# EasyEDA Pro project EasyEDA_DEHHANI_Yassine_Evaluation2_Electronique.epro

# Schematic Schematics
Board Name: Board1; Create Date: 2024-12-16; Page Name: Circuit; Project Name: DEHHANI_Yassine_Evaluation2_Electronique; Schematic Name: Schematics; Update Date: 2024-12-16; Company: EasyEDA.com; Page Size: A4; Version: V1.0
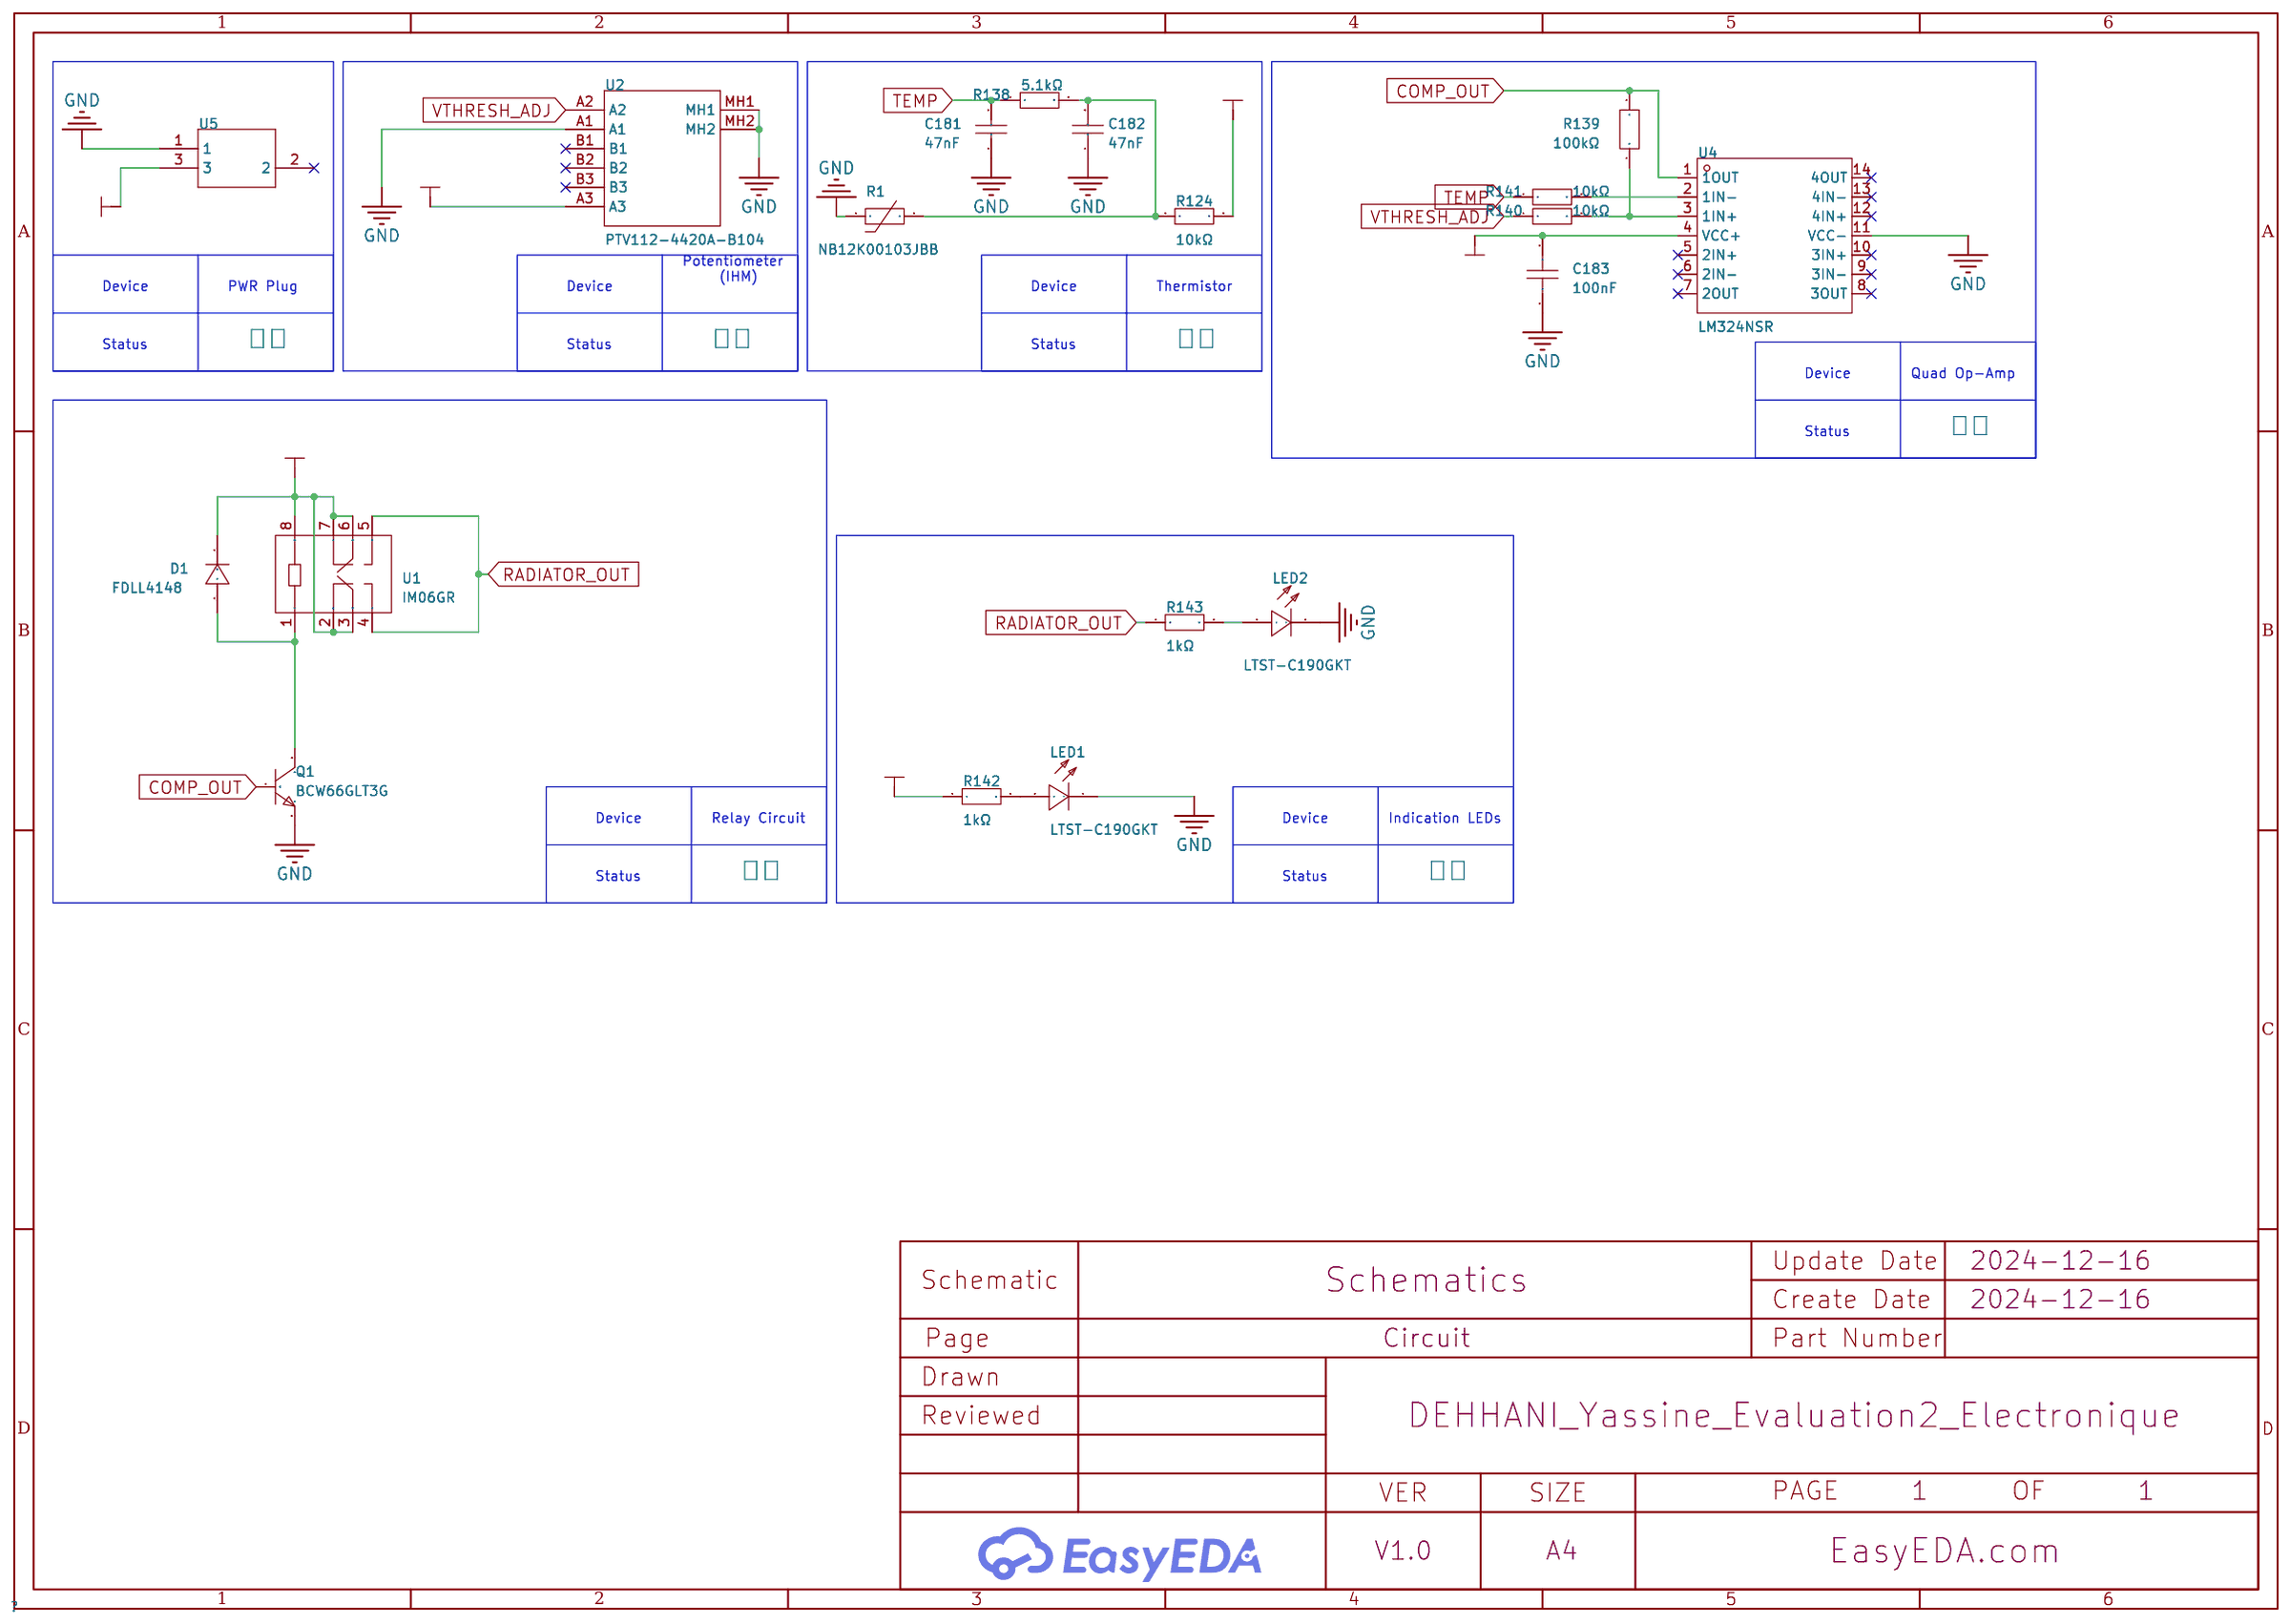
[diagram p0: schematic sheet]

## Parts
C181  47nF  [C0402]
C182  47nF  [C0402]
C183  100nF  [C0805]
D1  FDLL4148  [SOD-80_L3.5-W1.5-RD]
LED1  LTST-C190GKT  [LED0603-RD]
LED2  LTST-C190GKT  [LED0603-RD]
Q1  BCW66GLT3G  [SOT-23-3_L2.9-W1.3-P1.90-LS2.4-BR]
R1  NB12K00103JBB  [R0805]
R124  10kΩ  [R0402]
R138  5.1kΩ  [R0402]
R139  100kΩ  [R0805]
R140  10kΩ  [R0805]
R141  10kΩ  [R0805]
R142  1kΩ  [R0805]
R143  1kΩ  [R0805]
U1  IM06GR  [RELAY-SMD_IMXXGR]
U2  PTV112-4420A-B104  [PTV1124420AB104]
U4  LM324NSR  [SO-14_L10.2-W5.3-P1.27-LS7.8-BL]
U5  -  [PJ1021SMTTR]

## Library data of the parts
C181 C182 = 0402B473K500NT: Capacitance:47nF Tolerance:±10% Tolerance:±10% Voltage Rated: Temperature Coefficient:; LCSC Part Name: 47nF ±10% 50V; Supplier Part: C82219; Manufacturer: FH(风华); Supplier Footprint: 0402; JLCPCB Part Class: Extended Part; Datasheet: https://atta.szlcsc.com/upload/public/pdf/source/20200305/C486355_26A10D38EF8C2A5C37091D0039909270.pdf; Supplier: LCSC; Tolerance: ±10%
C183 = CC0805KRX7R9BB104: Capacitance: Tolerance:±10% Tolerance:±10% Voltage Rated: Temperature Coefficient:; LCSC Part Name: 100nF ±10% 50V; Supplier Part: C49678; Manufacturer: YAGEO(国巨); Supplier Footprint: 0805; JLCPCB Part Class: Basic Part; Datasheet: https://atta.szlcsc.com/upload/public/pdf/source/20180224/C181747_15194369449651363981.pdf; Supplier: LCSC; Tolerance: ±10%
D1 = FDLL4148: Diode Configuration: Forward Voltage (Vf@If):1V@10mA Reverse Voltage (Vr): Rectified Current: Reverse Leakage Current:5uA@75V Reverse Recovery Time (trr): Operating Temperature:-55℃~+175℃ Operating Temperature:-55℃~+175℃; LCSC Part Name: 电压:100V 电流:200mA; Supplier Part: C78608; Manufacturer: onsemi(安森美); Supplier Footprint: SOD-80; JLCPCB Part Class: Extended Part; Datasheet: https://atta.szlcsc.com/upload/public/pdf/source/20221020/952944402E52E23E5C6A007D10038C14.pdf; Supplier: LCSC; Forward Voltage (Vf@If): 1V@10mA; Reverse Leakage Current: 5uA@75V; Operating Temperature: -55℃~+175℃
LED1 LED2 = LTST-C190GKT: Emitted Color:Yellow Green Forward Voltage (VF):2.1V Forward Voltage (VF):2.1V Power Dissipation:100mW Forward Current:20mA Dominant Wavelength:569nm Dominant Wavelength:569nm Peak Wavelength:565nm Diode Configuration:- Lens Color:Colorless Transparent Le; LCSC Part Name: 普绿/黄绿; Supplier Part: C125093; Manufacturer: LITEON(光宝); Supplier Footprint: 0603; JLCPCB Part Class: Extended Part; Datasheet: https://atta.szlcsc.com/upload/public/pdf/source/20180326/C125093_24EC4C6D214E1CE2A6C2F0B82DCA7C02.pdf; Supplier: LCSC; Emitted Color: Yellow Green; Forward Voltage (VF): 2.1V; Power Dissipation: 100mW; Forward Current: 20mA; Dominant Wavelength: 569nm; Peak Wavelength: 565nm; Lens Color: Colorless Transparent Lens; Luminous Intensity: 6mcd; Viewing Angle: 130°; Operating Temperature: -55℃~+85℃
Q1 = BCW66GLT3G: Transistor Type: Collector Current (Ic): Collector-Emitter Breakdown Voltage (Vceo): Power Dissipation (Pd): DC Current Gain (hFE@Ic,Vce):160@100mA,1V DC Current Gain (hFE@Ic,Vce):160@100mA,1V Transition Frequency (fT):100MHz Collector Cut-Off Current (Ic; LCSC Part Name: 耐压:45V 电流:800mA NPN; Supplier Part: C896685; Manufacturer: onsemi(安森美); Supplier Footprint: SOT-23; JLCPCB Part Class: Extended Part; Datasheet: https://atta.szlcsc.com/upload/public/pdf/source/20210816/F4BA3618189A24FF990142DF8F515235.pdf; Supplier: LCSC; DC Current Gain (hFE@Ic,Vce): 160@100mA,1V; Transition Frequency (fT): 100MHz; Collector Cut-Off Current (Icbo): 20nA; Collector-Emitter Saturation Voltage (VCE(sat)@Ic,Ib): 250mV@100mA,5mA; Operating Temperature: -55℃~+150℃@(Tj)
R1 = NB12K00103JBB: Supplier Part: C597653; Manufacturer: Kyocera AVX; Supplier Footprint: 0805; JLCPCB Part Class: Extended Part; Datasheet: https://atta.szlcsc.com/upload/public/pdf/source/20230915/A3198BCB39D04DCD6DE66241F305DBB6.pdf; Supplier: LCSC
R124 = RC0402FR-0710KL: Type:Thick Film Resistors Resistance: Tolerance:±1% Tolerance:±1% Power(Watts): Overload Voltage (Max): Temperature Coefficient:±100ppm/℃ Temperature Coefficient:±100ppm/℃ Operating Temperature Range:-55℃~+155℃ Operating Temperature Range:-55℃~+155℃; LCSC Part Name: 厚膜电阻 10kΩ ±1% 62.5mW; Supplier Part: C60490; Manufacturer: YAGEO(国巨); Supplier Footprint: 0402; JLCPCB Part Class: Extended Part; Datasheet: https://atta.szlcsc.com/upload/public/pdf/source/20170925/C131467_1506321478108990263.pdf; Supplier: LCSC; Type: Thick Film Resistors; Tolerance: ±1%; Temperature Coefficient: ±100ppm/℃; Operating Temperature Range: -55℃~+155℃
R138 = RK73H1ETTP5101F: Type:Thick Film Resistors Resistance: Tolerance:±1% Tolerance:±1% Power(Watts): Overload Voltage (Max): Temperature Coefficient:±100ppm/℃ Temperature Coefficient:±100ppm/℃ Operating Temperature Range:-55℃~+155℃ Operating Temperature Range:-55℃~+155℃; LCSC Part Name: 厚膜电阻 5.1kΩ ±1% 100mW; Supplier Part: C159990; Manufacturer: KOA; Supplier Footprint: 0402; JLCPCB Part Class: Extended Part; Datasheet: https://atta.szlcsc.com/upload/public/pdf/source/20190516/C346145_73DC9C40D36D5A63BE57BD2EFB7F1781.pdf; Supplier: LCSC; Type: Thick Film Resistors; Tolerance: ±1%; Temperature Coefficient: ±100ppm/℃; Operating Temperature Range: -55℃~+155℃
R139 = SCR0805J100K: Type:Thick Film Resistors Resistance: Tolerance:±5% Tolerance:±5% Power(Watts): Overload Voltage (Max): Operating Temperature Range:-55℃~+155℃ Operating Temperature Range:-55℃~+155℃; LCSC Part Name: 厚膜电阻 100kΩ ±5% 125mW; Supplier Part: C3017875; Manufacturer: VO(翔胜); Supplier Footprint: 0805; JLCPCB Part Class: Extended Part; Datasheet: https://atta.szlcsc.com/upload/public/pdf/source/20220513/247AF9639BA21CF93567DC289CCC6A22.pdf; Supplier: LCSC; Type: Thick Film Resistors; Tolerance: ±5%; Operating Temperature Range: -55℃~+155℃
R140 R141 = RC0805FR-0710KL: Type:Thick Film Resistors Resistance: Tolerance:±1% Tolerance:±1% Power(Watts): Overload Voltage (Max): Temperature Coefficient:±100ppm/℃ Temperature Coefficient:±100ppm/℃ Operating Temperature Range:-55℃~+155℃ Operating Temperature Range:-55℃~+155℃; LCSC Part Name: 厚膜电阻 10kΩ ±1% 125mW; Supplier Part: C84376; Manufacturer: YAGEO(国巨); Supplier Footprint: 0805; JLCPCB Part Class: Extended Part; Datasheet: https://atta.szlcsc.com/upload/public/pdf/source/20170708/1499509500945.pdf; Supplier: LCSC; Type: Thick Film Resistors; Tolerance: ±1%; Temperature Coefficient: ±100ppm/℃; Operating Temperature Range: -55℃~+155℃
R142 R143 = RC0805FR-071KL: Type:Thick Film Resistors Resistance: Tolerance:±1% Tolerance:±1% Power(Watts): Overload Voltage (Max): Temperature Coefficient:±100ppm/℃ Temperature Coefficient:±100ppm/℃ Operating Temperature Range:-55℃~+155℃ Operating Temperature Range:-55℃~+155℃; LCSC Part Name: 厚膜电阻 1kΩ ±1% 125mW; Supplier Part: C95781; Manufacturer: YAGEO(国巨); Supplier Footprint: 0805; JLCPCB Part Class: Extended Part; Datasheet: https://atta.szlcsc.com/upload/public/pdf/source/20170708/1499509500945.pdf; Supplier: LCSC; Type: Thick Film Resistors; Tolerance: ±1%; Temperature Coefficient: ±100ppm/℃; Operating Temperature Range: -55℃~+155℃
U1 = IM06GR: Coil Voltage:12V Contact Form:两组转换:2C(DPDT-转换) Contact Rating:- Maximum Switching Voltage:250V@AC；220V@DC Contact Material:- Coil Resistance:- Maximum Switching Current:2A Operate Time:3ms Release Time:3ms Coil Type:- Contact Resistance:- Operating Temper; LCSC Part Name: 12VDC 2A 无锁存; Supplier Part: C2153106; Manufacturer: TE Connectivity(泰科电子); Supplier Footprint: SMD,6x10mm; JLCPCB Part Class: Extended Part; Datasheet: https://atta.szlcsc.com/upload/public/pdf/source/20210703/113EB0DC59A6912044DEF7D49CC0F43B.pdf; Supplier: LCSC; Coil Voltage: 12V; Contact Form: 两组转换:2C(DPDT-转换); Maximum Switching Voltage: 250V@AC；220V@DC; Maximum Switching Current: 2A; Operate Time: 3ms; Release Time: 3ms; Operating Temperature: -40℃~+85℃
U2 = PTV112-4420A-B104
U4 = LM324NSR: Supplier Part: C2057487; Manufacturer: TI(德州仪器); Supplier Footprint: SO-14-208mil; JLCPCB Part Class: Extended Part; Datasheet: https://www.ti.com/cn/lit/gpn/lm224a; Supplier: LCSC
U5 = PJ1-021-SMT-TR

## Nets
+12V: C183.2 D1.1(C) R124.2 R142.1 U1.2 U1.3 U1.6 U1.7 U1.8 U2.A3 U4.4(VCC+) U5.3
GND: C181.1 C182.1 C183.1 LED1.1(-) LED2.1(-) Q1.2(E) R1.1 U2.A1 U2.MH1 U2.MH2 U4.11(VCC-) U5.1
COMP_OUT: Q1.1(B) R139.2 U4.1(1OUT)
RADIATOR_OUT: R143.1 U1.4 U1.5
TEMP: C181.2 R138.1 R141.1
VTHRESH_ADJ: R140.1 U2.A2
$1N1245: C182.2 R1.2 R124.1 R138.2
$1N1427: D1.2(A) Q1.3(C) U1.1
$1N2420: R139.1 R140.2 U4.3(1IN+)
$1N2469: R141.2 U4.2(1IN-)
$1N2706: LED1.2(+) R142.2
$1N3010: LED2.2(+) R143.2

Not connected (* = marked no-connect by the designer): U2 B1* B2* B3*; U4 5(2IN+)* 6(2IN-)* 7(2OUT)* 8(3OUT)* 9(3IN-)* 10(3IN+)* 12(4IN+)* 13(4IN-)* 14(4OUT)*; U5 2*

## Notes on the sheet
- Device
- PWR Plug
- Device
- Potentiometer
       (IHM)
- Device
- Thermistor
- Status
- ✓✓
- Status
- ✓✓
- Status
- ✓✓
- Device
- Quad Op-Amp
- Status
- ✓✓
- Device
- Relay Circuit
- Device
- Indication LEDs
- Status
- ✓✓
- Status
- ✓✓

# Board Radiator Control PCB
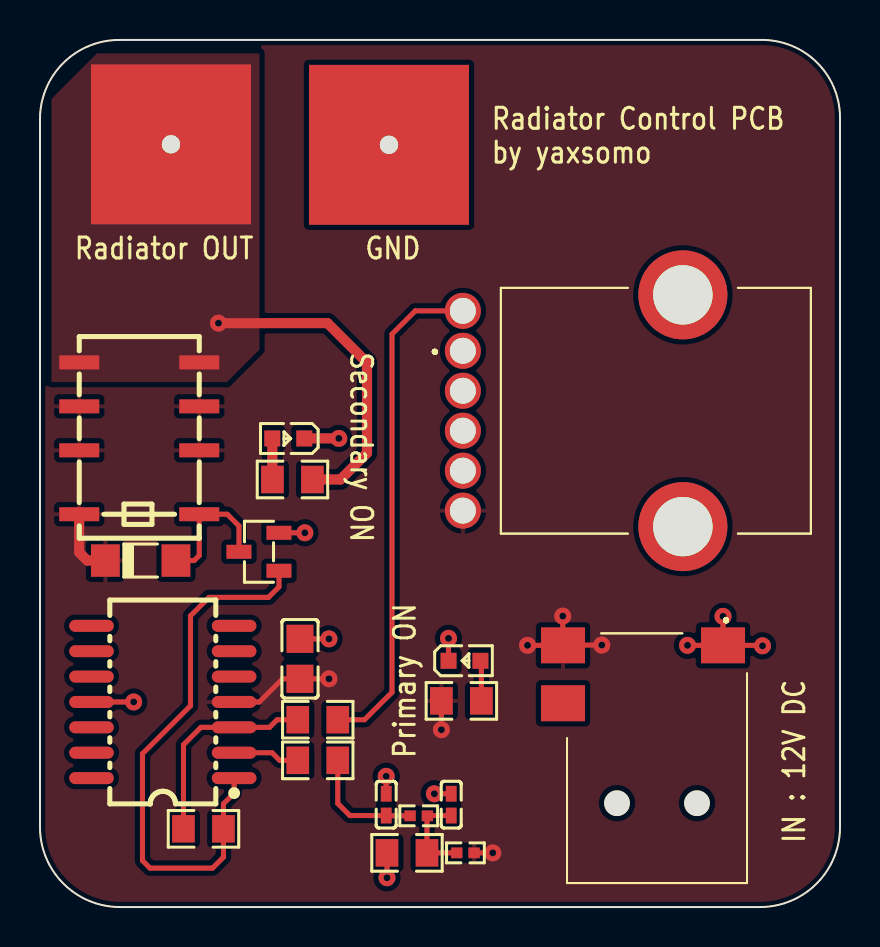
[diagram p1: board, top side]
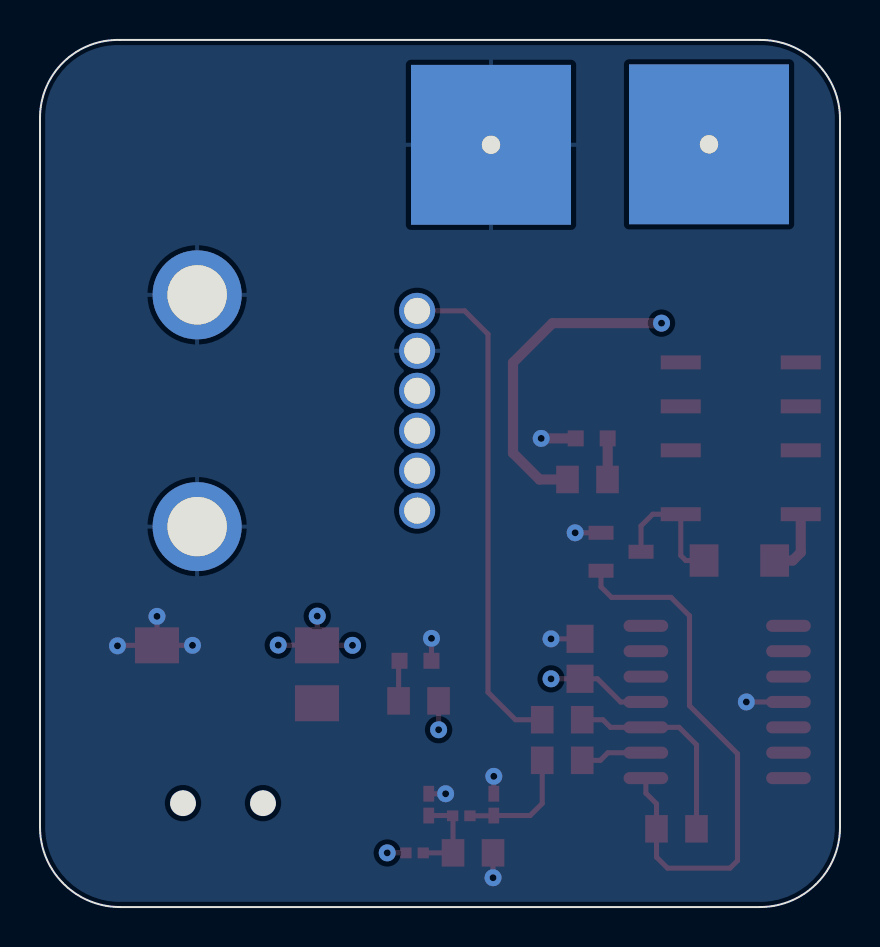
[diagram p2: board, bottom side, seen from below]

Outline 40 x 43.4 mm; copper layers: Top Layer, Bottom Layer. Coordinates in mm from the lower left corner of the outline.
Outline path: 0,39.45 0,4 arc(1.17,1.17) 4,0 36,0 arc(38.83,1.17) 40,4 40,39.52 arc(38.82,42.3) 36,43.4 4,43.4 arc(1.18,42.26) 0,39.45
Stack: Top Layer 0.035mm / Dielectric1 1.51mm FR4 er 4.5 / Bottom Layer 0.035mm

## Design rules (mm)
template: JLCPCB Capability(Two Layers Board)
spacing copperThickness1oz (default): track to track 0.102, other pairs 0.152 to 0.3
spacing copperThickness2oz: track to track 0.203, other pairs 0.152 to 0.3
track width copperThickness1oz (default): min 0.127, default 0.254, max 2.54
track width copperThickness2oz: min 0.203, default 0.254, max 2.54
differential pair differentialPair (default): width min 0.127, default 0.254, max 2.54; gap min 0.152, default 0.152
via viaSize (default): diameter min 0.5, default 0.61, max 10; hole min 0.3, default 0.305, max 6.3

## Placement (name value [footprint] x y rotation side)
C181  47nF  [C0402]  17.31 5.12 270 top
C182  47nF  [C0402]  20.56 5.12 270 top
C183  100nF  [C0805]  13 12.42 270 top
D1  FDLL4148  [SOD-80_L3.5-W1.5-RD]  5.03 17.34 0 top
LED1  LTST-C190GKT  [LED0603-RD]  21.22 12.32 0 top
LED2  LTST-C190GKT  [LED0603-RD]  12.42 23.46 180 top
NOREF  -  [Pad_e403]  17.45 38.15 0 top
NOREF#2  -  [Pad_e398]  6.55 38.18 0 top
Q1  BCW66GLT3G  [SOT-23-3_L2.9-W1.3-P1.90-LS2.4-BR]  10.95 17.78 0 top
R1  NB12K00103JBB  [R0805]  18.35 2.71 0 top
R124  10kΩ  [R0402]  21.27 2.71 0 top
R138  5.1kΩ  [R0402]  18.94 4.57 0 top
R139  100kΩ  [R0805]  8.17 3.91 0 top
R140  10kΩ  [R0805]  13.89 9.38 180 top
R141  10kΩ  [R0805]  13.89 7.34 180 top
R142  1kΩ  [R0805]  21.07 10.32 0 top
R143  1kΩ  [R0805]  12.62 21.4 180 top
U1  IM06GR  [RELAY-SMD_IMXXGR]  4.96 23.46 90 top
U2  PTV112-4420A-B104  [PTV1124420AB104]  21.14 27.84 270 top
U4  LM324NSR  [SO-14_L10.2-W5.3-P1.27-LS7.8-BL]  6.14 10.26 90 top
U5  -  [PJ1021SMTTR]  30.85 7.45 90 top

## Footprints (pads in the part's own frame, mm; a bottom-side part is the same pattern mirrored in y, then rotated)
C0402
  rect 0.79x0.54 smd: 1(-0.545,0) 2(0.545,0)
C0805
  rect 1.41x1.35 smd: 1(-1,0) 2(1,0)
LED0603-RD
  rect 0.8x0.8 smd: 1(-0.799,0) 2(0.799,0)
Pad_e398
  rect 8x8 hole 0.914: 1(0,0)
Pad_e403
  rect 8x8 hole 0.914: 1(0,0)
PJ1021SMTTR
  rect 1.8x2.2 smd: 1(5.65,-3.3) 2(2.75,4.7) 3(5.65,4.7)
PTV1124420AB104
  round 1.8 hole 1.3: A1(0,0) A2(-2,0) A3(8,0) B1(2,0) B2(4,0) B3(6,0)
  round 4.455 hole 2.97: MH1(-2.8,11) MH2(8.8,11)
R0402
  rect 0.566x0.54 smd: 1(-0.433,0) 2(0.433,0)
R0805
  rect 1.133x1.377 smd: 1(-1,0) 2(1,0)
RELAY-SMD_IMXXGR
  rect 0.7x2 smd: 1(-3.8,-3) 2(-0.6,-3) 3(1.6,-3) 4(3.8,-3) 5(3.8,3) 6(1.6,3) 7(-0.6,3) 8(-3.8,3)
SO-14_L10.2-W5.3-P1.27-LS7.8-BL
  oval 0.602x2.231 smd: 1(-3.81,-3.565) 2(-2.54,-3.565) 3(-1.27,-3.565) 4(0,-3.565) 5(1.27,-3.565) 6(2.54,-3.565) 7(3.81,-3.565) 8(3.81,3.566) 9(2.54,3.566) 10(1.27,3.566) 11(0,3.566) 12(-1.27,3.566) 13(-2.54,3.566) 14(-3.81,3.566)
SOD-80_L3.5-W1.5-RD
  rect 1.44x1.62 smd: 1(-1.765,0) 2(1.765,0)
SOT-23-3_L2.9-W1.3-P1.90-LS2.4-BR
  rect 1.25x0.7 smd: 1(1,-0.95) 2(1,0.95) 3(-1,0)

## Nets
As in the schematic, except:
GND: C181.1 C182.1 C183.1 LED1.1 LED2.1 NOREF.1 Q1.2 R1.1 U2.A1 U2.MH1 U2.MH2 U4.11 U5.1
RADIATOR_OUT: NOREF#2.1 R143.1 U1.4 U1.5

Pads without a net: U2 B1 B2 B3; U4 5 6 7 8 9 10 12 13 14; U5 2

## Via types
v1: diameter 0.85, hole 0.35, Top Layer to Bottom Layer, 18 vias

## Routing (per net, layer and track width the routed paths; a pad name or vN(x,y) marks a point on that pad's centre or on a via; arc(x,y) is an arc through that point)
+12V: length 16.2
  Top Layer w0.254: v1(28.09,13.11) 26.14,13.11 ; 26.14,13.11 U5.3 v1(24.38,13.1) ; 26.14,13.11 v1(26.14,14.56) ; 9.71,10.26 10.97,10.26 12.13,11.42 C183.2 v1(14.45,11.42) ; R142.1 v1(20.07,8.87) ; R124.2 v1(22.64,2.71)
  Top Layer w0.508: U1.8 1.96,17.75 2.37,17.34 D1.1
GND: length 15.9
  Top Layer w0.254: U5.1 36.1,13.1 v1(36.13,13.07) ; U5.1 v1(32.38,13.1) ; U5.1 v1(34.15,14.55) ; R1.1 v1(17.35,1.47) ; C182.1 v1(19.72,5.67) ; C183.1 v1(14.45,13.42) ; Q1.2 v1(13.24,18.73) ; U4.11 v1(4.68,10.26) ; C181.1 v1(17.31,6.54) ; LED1.1 v1(20.43,13.45)
  Top Layer w0.508: LED2.1 v1(14.94,23.46)
COMP_OUT: length 27.7
  Top Layer w0.254: 9.71,6.45 9.71,5.7 9.17,5.17 R139.2 9.17,2.5 8.62,1.95 5.5,1.95 5.12,2.32 5.12,7.67 7.52,10.07 7.52,14.57 8.45,15.5 11.42,15.5 11.95,16.02 Q1.1
RADIATOR_OUT: length 16
  Top Layer w0.508: R143.1 15.03,21.4 16.35,22.72 16.35,27.25 14.37,29.22 v1(8.92,29.22)
TEMP: length 6
  Top Layer w0.254: R141.1 14.89,5.19 15.49,4.58 C181.2 17.32,4.57 R138.1
VTHRESH_ADJ: length 25.2
  Top Layer w0.254: R140.1 16.23,9.38 17.6,10.75 17.6,28.67 18.77,29.84 U2.A2
$1N1245: length 4.5
  Top Layer w0.254: 20.84,2.71 R1.2 19.35,4.55 R138.2 19.38,4.58 C182.2
$1N1427: length 6.9
  Top Layer w0.254: D1.2 7.71,17.34 7.96,17.6 U1.1 9.36,19.66 9.95,19.07 Q1.3
$1N2420: length 10.4
  Top Layer w0.254: R140.2 11.86,9.38 11.48,8.99 8.05,8.99 7.17,8.12 R139.1
$1N2469: length 3.3
  Top Layer w0.254: 9.71,7.72 11.6,7.72 11.98,7.34 R141.2
$1N2706: length 2
  Top Layer w0.254: LED1.2 22.07,12.28 R142.2
$1N3010: length 2.1
  Top Layer w0.508: 11.65,21.4 11.62,21.4 LED2.2

## Copper pours and planes (outline as drawn; the poured copper is in the pictures)
+12V on Top Layer: -2.15,43.73 40.98,43.73 40.98,-1.28 -2.15,-1.28
GND on Bottom Layer: -1.85,44.3 41.38,44.3 41.38,-1.08 -1.85,-1.08
RADIATOR_OUT on Top Layer: 0.57,42.73 10.97,42.73 10.97,26.28 0.57,26.28

## Text on the board
Top Silkscreen Layer: Radiator OUT | GND | Radiator Control PCB / by yaxsomo | Primary ON | IN : 12V DC | Secondary ON
